# Altium schematic sheet ControlBoard.SchDoc
size A4
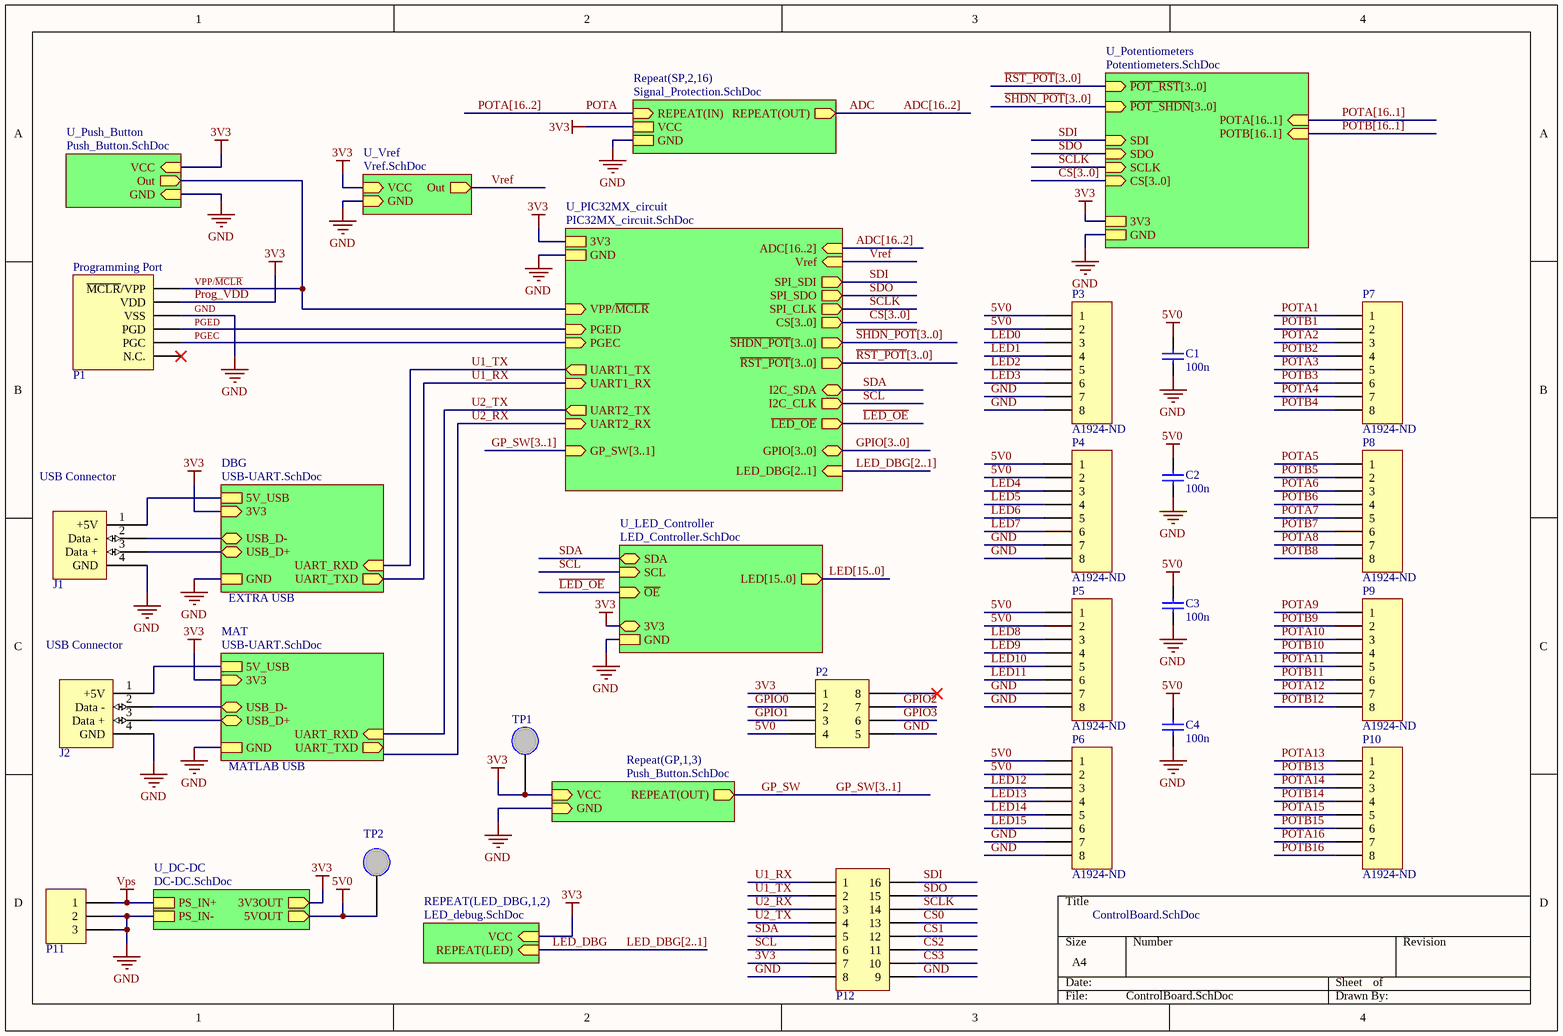
[diagram p0: ControlBoard.SchDoc]

## Parts
C1  value 100n  [CS-0603]  (hidden comment: CS - CAPACITOR)
C2  value 100n  [CS-0603]  (hidden comment: CS - CAPACITOR)
C3  value 100n  [CS-0603]  (hidden comment: CS - CAPACITOR)
C4  value 100n  [CS-0603]  (hidden comment: CS - CAPACITOR)
J1  USB 4 pins  [CON-USB TYPE B]  (value not drawn)
J2  USB 4 pins  [CON-USB TYPE B]  (value not drawn)
P1  CON - HEADER PROG  [CON-HEADER-1X6-RA]  (value not drawn)
P2  CON - HEADER 2X4  [CON-HEADER-2X4]  (value not drawn)
P3  Supplier Part Number 1: A1924-ND  [CON-HEADER-1X8]  (hidden comment: CON - HEADER 1X8)
P4  Supplier Part Number 1: A1924-ND  [CON-HEADER-1X8]  (hidden comment: CON - HEADER 1X8)
P5  Supplier Part Number 1: A1924-ND  [CON-HEADER-1X8]  (hidden comment: CON - HEADER 1X8)
P6  Supplier Part Number 1: A1924-ND  [CON-HEADER-1X8]  (hidden comment: CON - HEADER 1X8)
P7  Supplier Part Number 1: A1924-ND  [CON-HEADER-1X8]  (hidden comment: CON - HEADER 1X8)
P8  Supplier Part Number 1: A1924-ND  [CON-HEADER-1X8]  (hidden comment: CON - HEADER 1X8)
P9  Supplier Part Number 1: A1924-ND  [CON-HEADER-1X8]  (hidden comment: CON - HEADER 1X8)
P10  Supplier Part Number 1: A1924-ND  [CON-HEADER-1X8]  (hidden comment: CON - HEADER 1X8)
P11  CON - POWER CONNECTOR  [CON-POWER CONNECTOR]  (value not drawn)
P12  CON - HEADER 2X8  [CON-HEADER-2X8]  (value not drawn)
TP1  5003K  [TP - VERTICAL]  (value not drawn)
TP2  5003K  [TP - VERTICAL]  (value not drawn)

## Sub-sheets
DBG = USB-UART.SchDoc: 3V3 (in), GND, UART_RXD (in), UART_TXD (out), 5V_USB, USB_D- (bidir), USB_D+ (bidir)
MAT = USB-UART.SchDoc: 3V3 (in), GND, UART_RXD (in), UART_TXD (out), 5V_USB, USB_D- (bidir), USB_D+ (bidir)
Repeat(GP,1,3) = Push_Button.SchDoc: REPEAT(OUT) (out), GND (in), VCC (in)
REPEAT(LED_DBG,1,2) = LED_debug.SchDoc: VCC (in), REPEAT(LED) (in)
Repeat(SP,2,16) = Signal_Protection.SchDoc: REPEAT(IN) (in), REPEAT(OUT) (out), VCC, GND
U_DC-DC = DC-DC.SchDoc: 3V3OUT (out), 5VOUT (out), PS_IN+, PS_IN-
U_LED_Controller = LED_Controller.SchDoc: SDA (bidir), SCL (in), ~{OE} (in), LED[15..0] (out), GND, 3V3
U_PIC32MX_circuit = PIC32MX_circuit.SchDoc: 3V3, GND, UART2_TX (out), UART2_RX (in), GP_SW[3..1] (in), PGED (in), PGEC (in), VPP/~{MCLR} (in), ADC[16..2] (in), UART1_TX (out), UART1_RX (in), SPI_CLK (out), SPI_SDI (out), SPI_SDO (out), I2C_SDA (bidir), I2C_CLK (out), CS[3..0] (out), ~{LED_OE} (out), ~{RST_POT}[3..0] (out), ~{SHDN_POT}[3..0] (out), GPIO[3..0] (bidir), LED_DBG[2..1] (in), Vref (in)
U_Potentiometers = Potentiometers.SchDoc: SDI (in), SCLK (in), 3V3, GND, POTB[16..1] (in), CS[3..0] (in), ~{POT_RST}[3..0] (in), ~{POT_SHDN}[3..0] (in), SDO (in), POTA[16..1] (in)
U_Push_Button = Push_Button.SchDoc: Out (out), VCC (in), GND (in)
U_Vref = Vref.SchDoc: Out (out), VCC (in), GND (in)

## Nets
3V3: P1.2(VDD) P2.1 P12.7 TP1.1 ; sheet U_LED_Controller/3V3, sheet U_Potentiometers/3V3, sheet U_PIC32MX_circuit/3V3, sheet U_DC-DC/3V3OUT, sheet Repeat(GP,1,3)/VCC, sheet MAT/3V3, sheet DBG/3V3, sheet Repeat(SP,2,16)/VCC, sheet U_Push_Button/VCC, sheet REPEAT(LED_DBG,1,2)/VCC, sheet U_Vref/VCC  [also labelled Prog_VDD]
5V0: C1.1 C2.1 C3.1 C4.1 P2.4 P3.1 P3.2 P4.1 P4.2 P5.1 P5.2 P6.1 P6.2 TP2.1 ; sheet U_DC-DC/5VOUT
GND: C1.2 C2.2 C3.2 C4.2 J1.4(GND) J1.5(Shield) J1.6(Shield) J2.4(GND) J2.5(Shield) J2.6(Shield) P1.3(VSS) P2.5 P3.7 P3.8 P4.7 P4.8 P5.7 P5.8 P6.7 P6.8 P11.2 P11.3 P12.8 P12.9 ; sheet U_LED_Controller/GND, sheet U_Potentiometers/GND, sheet U_PIC32MX_circuit/GND, sheet U_DC-DC/PS_IN-, sheet Repeat(GP,1,3)/GND, sheet MAT/GND, sheet DBG/GND, sheet Repeat(SP,2,16)/GND, sheet U_Push_Button/GND, sheet U_Vref/GND
Vps: P11.1 ; sheet U_DC-DC/PS_IN+
ADC: sheet Repeat(SP,2,16)/REPEAT(OUT)
CS0: P12.13
CS1: P12.12
CS2: P12.11
CS3: P12.10
GP_SW: sheet Repeat(GP,1,3)/REPEAT(OUT)
GPIO0: P2.2
GPIO1: P2.3
GPIO2: P2.7
GPIO3: P2.6
~{LED_OE}: sheet U_LED_Controller/~{OE}, sheet U_PIC32MX_circuit/~{LED_OE}
LED0: P3.3
LED1: P3.4
LED2: P3.5
LED3: P3.6
LED4: P4.3
LED5: P4.4
LED6: P4.5
LED7: P4.6
LED8: P5.3
LED9: P5.4
LED10: P5.5
LED11: P5.6
LED12: P6.3
LED13: P6.4
LED14: P6.5
LED15: P6.6
LED_DBG: sheet REPEAT(LED_DBG,1,2)/REPEAT(LED)
PGEC: P1.5(PGC) ; sheet U_PIC32MX_circuit/PGEC
PGED: P1.4(PGD) ; sheet U_PIC32MX_circuit/PGED
POTA: sheet Repeat(SP,2,16)/REPEAT(IN)
POTA1: P7.1
POTA2: P7.3
POTA3: P7.5
POTA4: P7.7
POTA5: P8.1
POTA6: P8.3
POTA7: P8.5
POTA8: P8.7
POTA9: P9.1
POTA10: P9.3
POTA11: P9.5
POTA12: P9.7
POTA13: P10.1
POTA14: P10.3
POTA15: P10.5
POTA16: P10.7
POTB1: P7.2
POTB2: P7.4
POTB3: P7.6
POTB4: P7.8
POTB5: P8.2
POTB6: P8.4
POTB7: P8.6
POTB8: P8.8
POTB9: P9.2
POTB10: P9.4
POTB11: P9.6
POTB12: P9.8
POTB13: P10.2
POTB14: P10.4
POTB15: P10.6
POTB16: P10.8
SCL: P12.6 ; sheet U_LED_Controller/SCL, sheet U_PIC32MX_circuit/I2C_CLK
SCLK: P12.14 ; sheet U_Potentiometers/SCLK, sheet U_PIC32MX_circuit/SPI_CLK
SDA: P12.5 ; sheet U_LED_Controller/SDA, sheet U_PIC32MX_circuit/I2C_SDA
SDI: P12.16 ; sheet U_Potentiometers/SDI, sheet U_PIC32MX_circuit/SPI_SDI
SDO: P12.15 ; sheet U_Potentiometers/SDO, sheet U_PIC32MX_circuit/SPI_SDO
U1_RX: P12.1 ; sheet U_PIC32MX_circuit/UART1_RX, sheet DBG/UART_TXD
U1_TX: P12.2 ; sheet U_PIC32MX_circuit/UART1_TX, sheet DBG/UART_RXD
U2_RX: P12.3 ; sheet U_PIC32MX_circuit/UART2_RX
U2_TX: P12.4 ; sheet U_PIC32MX_circuit/UART2_TX, sheet MAT/UART_RXD
VPP/~{MCLR}: P1.1(~{MCLR}/VPP) ; sheet U_PIC32MX_circuit/VPP/~{MCLR}, sheet U_Push_Button/Out
Vref: sheet U_PIC32MX_circuit/Vref, sheet U_Vref/Out
NetJ1_1: J1.1(+5V) ; sheet DBG/5V_USB
NetJ1_2: J1.2(Data_-) ; sheet DBG/USB_D-
NetJ1_3: J1.3(Data_+) ; sheet DBG/USB_D+
NetJ2_1: J2.1(+5V) ; sheet MAT/5V_USB
NetJ2_2: J2.2(Data_-) ; sheet MAT/USB_D-
NetJ2_3: J2.3(Data_+) ; sheet MAT/USB_D+

Not connected (* = marked no-connect by the designer): P1 6(N.C.)*; P2 8*

## Buses and harness runs
bus ADC[16..2]
bus ADC[16..2] = sheet U_PIC32MX_circuit/ADC[16..2]
bus CS[3..0] = sheet U_PIC32MX_circuit/CS[3..0]
bus CS[3..0] = sheet U_Potentiometers/CS[3..0]
bus GP_SW[3..1]
bus GP_SW[3..1] = sheet U_PIC32MX_circuit/GP_SW[3..1]
bus GPIO[3..0] = sheet U_PIC32MX_circuit/GPIO[3..0]
bus LED[15..0] = sheet U_LED_Controller/LED[15..0]
bus LED_DBG[2..1]
bus LED_DBG[2..1] = sheet U_PIC32MX_circuit/LED_DBG[2..1]
bus POTA[16..1] = sheet U_Potentiometers/POTA[16..1]
bus POTA[16..2]
bus POTB[16..1] = sheet U_Potentiometers/POTB[16..1]
bus ~{RST_POT}[3..0] = sheet U_PIC32MX_circuit/~{RST_POT}[3..0]
bus ~{RST_POT}[3..0] = sheet U_Potentiometers/~{POT_RST}[3..0]
bus ~{SHDN_POT}[3..0] = sheet U_PIC32MX_circuit/~{SHDN_POT}[3..0]
bus ~{SHDN_POT}[3..0] = sheet U_Potentiometers/~{POT_SHDN}[3..0]

## Notes on the sheet
- (near P1) Programming Port
- (near J1) USB Connector
- (near J2) USB Connector
- EXTRA USB
- MATLAB USB

## Library data of the parts
C1-C4 = CS - CAPACITOR: TOLERANCE: 10%; VOLTAGE: 16V; Supplier 1: *; Supplier Part Number 1: *; (FIELD A): *; (FLIED C): *; (FIELD B): *; Manufacturer: *
J1 J2 = CON - USB TYPE B 4 pins: 4 pin USB connector with 2 shield pins; Manufacturer: FCI; Supplier 1: Digi-Key; Supplier Part Number 1: 609-3656-ND; (FLIED A): *; (FLIED B): *; (FLIED C): *
P1 = CON - PROG HEADER 6: MICROCHIP CONNECTOR; (FLIED A): *; (FLIED B): *; (FLIED C): *; Manufacturer: *; Supplier 1: Digi-Key; Supplier Part Number 1: 609-3263-ND
P2 = CON - HEADER 2X4: 100mil header 2 row 8pins; Manufacturer: *; (FIELD A): *; (FIELD B): *; (FIELD C): *; Supplier 1: Digi-Key; Supplier Part Number 1: 952-2122-ND
P3-P10 = CON - HEADER 1X8: 100mil header 1 row 6 pins; Manufacturer: *; (FIELD A): *; (FIELD B): *; (FIELD C): *; Supplier 1: Digi-Key
P11 = CON - POWER CONNECTOR: CONN PWR JACK 2.1X5.5MM HIGH CUR; Manufacturer: *; (FIELD A): *; (FIELD B): *; (FIELD C): *; Supplier 1: Digi-Key; Supplier Part Number 1: CP-002AH-ND
P12 = CON - HEADER 2X8: 100mil header 2 row 16pins; Manufacturer: *; (FIELD A): *; (FIELD B): *; (FIELD C): *; Supplier 1: Digi-Key; Supplier Part Number 1: 952-2128-ND
TP1 TP2 = TP - Test point vertical: (FIELD A): *; (FIELD B): *; (FIELD C): *; Manufacturer: *; Supplier 1: Newark; Supplier Part Number 1: 62W5140